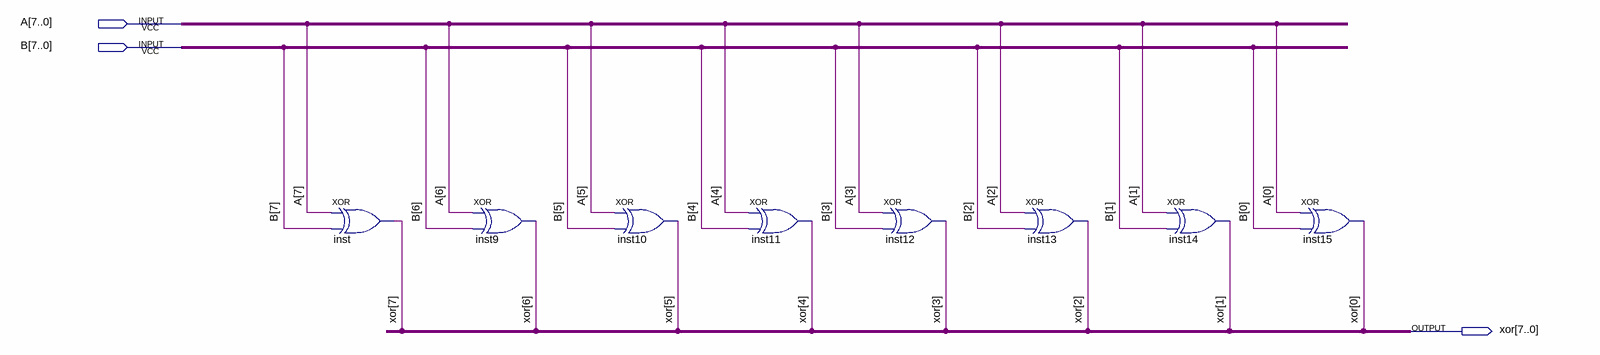
[diagram p0: schematic sheet]
// Quartus schematic xor_logic8bit.bdf as structural Verilog: 8 symbols, 3 pins
module xor_logic8bit (
  input  [7:0] A,
  input  [7:0] B,
  output [7:0] \xor 
);

  xor inst (\xor [7], A[7], B[7]);
  xor inst9 (\xor [6], A[6], B[6]);
  xor inst10 (\xor [5], A[5], B[5]);
  xor inst11 (\xor [4], A[4], B[4]);
  xor inst12 (\xor [3], A[3], B[3]);
  xor inst13 (\xor [2], A[2], B[2]);
  xor inst14 (\xor [1], A[1], B[1]);
  xor inst15 (\xor [0], A[0], B[0]);
endmodule
